# Altium schematic sheet microB.SchDoc
size 66 x 47 mm; Origin: Eagle
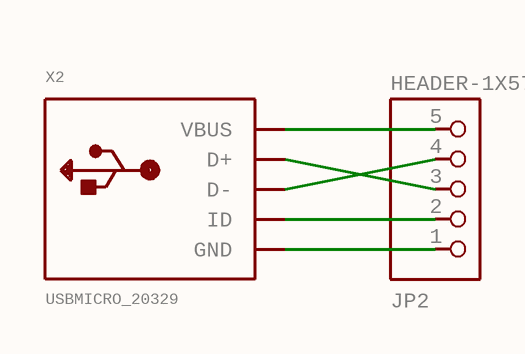
[diagram p0: microB.SchDoc]

## Parts
JP2  HEADER-1X570MIL  [1X05_ROUND_70]
X2  USBMICRO_20329  [4UCONN_20329]

## Nets
NetJP2_1: JP2.1 X2.BASE@1_BASE@2_GND_SPRT@1_SPRT@2_SPRT@3_SPRT@4(GND)
NetJP2_2: JP2.2 X2.ID
NetJP2_3: JP2.3 X2.D+
NetJP2_4: JP2.4 X2.D-
NetJP2_5: JP2.5 X2.VBUS

## Library data of the parts
JP2 = HEADER-1X570MIL: PIN HEADER; GateName_1: A; SymbolName_1: PINHD5; DeviceName: 70MIL; LibraryName: microbuilder; DeviceSetName: HEADER-1X5
X2 = USBMICRO_20329: USB ConnectorsUSBMINIB - Surface Mount Female Mini-B USB Connector    4UConnector: 06564; GateName_1: G$1; SymbolName_1: USB; DeviceName: MICRO_20329; LibraryName: microbuilder; DeviceSetName: USB